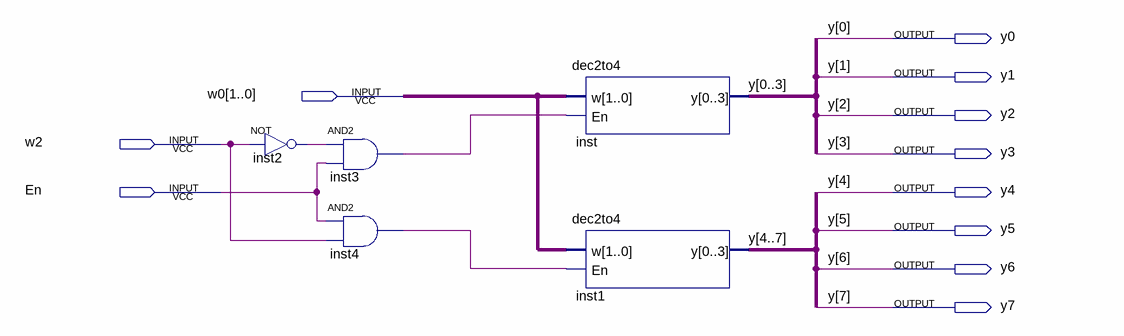
[diagram p0: schematic sheet]
// Quartus schematic decodModified.bdf as structural Verilog: 5 symbols, 11 pins
module decodModified (
  input  [1:0] w0,
  input  w2,
  input  En,
  output y0,
  output y1,
  output y2,
  output y3,
  output y4,
  output y5,
  output y6,
  output y7
);

  wire inst2_out, inst3_out, inst4_out;

  not inst2 (inst2_out, w2);
  and inst3 (inst3_out, inst2_out, En);
  and inst4 (inst4_out, En, w2);
  dec2to4 inst (.w(w0), .En(inst3_out), .y({y0, y1, y2, y3}));
  dec2to4 inst1 (.w(w0), .En(inst4_out), .y({y4, y5, y6, y7}));
endmodule
